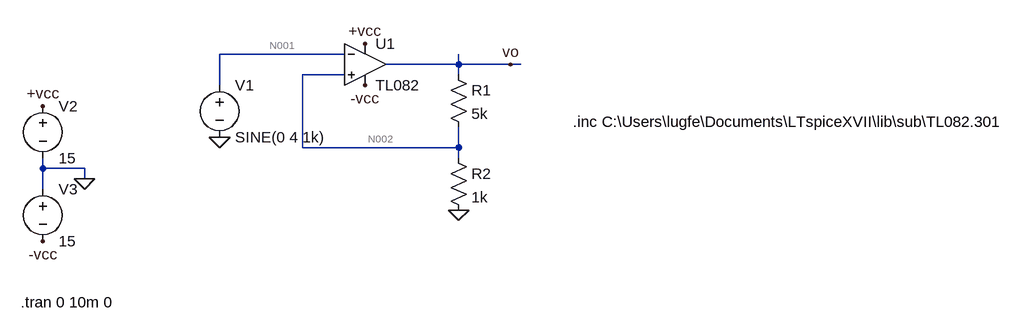
[diagram p0: schematic Draft3.asc]
Draft3.asc, the LTspice schematic file:
Version 4
SHEET 1 1196 680
WIRE 176 48 -16 48
WIRE 352 64 352 48
WIRE 352 64 240 64
WIRE 432 64 352 64
WIRE 448 64 432 64
WIRE 176 80 112 80
WIRE 352 80 352 64
WIRE -16 96 -16 48
WIRE 112 192 112 80
WIRE 352 192 352 160
WIRE 352 192 112 192
WIRE 352 208 352 192
WIRE -288 224 -288 208
WIRE -224 224 -288 224
WIRE -224 240 -224 224
WIRE -288 256 -288 224
FLAG -224 240 0
FLAG -288 336 -vcc
FLAG -288 128 +vcc
FLAG 208 32 +vcc
FLAG 352 288 0
FLAG -16 176 0
FLAG 432 64 vo
FLAG 208 96 -vcc
SYMBOL voltage -16 80 R0
WINDOW 123 24 124 Left 2
WINDOW 39 0 0 Left 0
SYMATTR InstName V1
SYMATTR Value SINE(0 4 1k)
SYMBOL Opamps\\opamp2 208 0 R0
SYMATTR InstName U1
SYMATTR Value TL082
SYMBOL voltage -288 112 R0
WINDOW 123 0 0 Left 0
WINDOW 39 0 0 Left 0
SYMATTR InstName V2
SYMATTR Value 15
SYMBOL voltage -288 240 R0
WINDOW 123 0 0 Left 0
WINDOW 39 0 0 Left 0
SYMATTR InstName V3
SYMATTR Value 15
SYMBOL res 336 64 R0
SYMATTR InstName R1
SYMATTR Value 5k
SYMBOL res 336 192 R0
SYMATTR InstName R2
SYMATTR Value 1k
TEXT 528 152 Left 2 !.inc C:\\Users\\lugfe\\Documents\\LTspiceXVII\\lib\\sub\\TL082.301
TEXT -322 430 Left 2 !.tran 0 10m 0

The netlist it stands for:
* Draft3.asc
V1 N001 0 SINE(0 4 1k)
XU1 N002 N001 +vcc -vcc vo TL082  ; pins In+ In- V+ V- OUT
V2 +vcc 0 15
V3 0 -vcc 15
R1 vo N002 5k
R2 N002 0 1k
.inc C:\Users\lugfe\Documents\LTspiceXVII\lib\sub\TL082.301
.tran 0 10m 0
.backanno
.end

* Results of the author's LTspice run, read from the files saved beside the schematic
* Operating Point, zero values left out:
*   V(vo) = 13.48 V
*   V(-vcc) = -15 V
*   V(+vcc) = 15 V
*   V(n002) = 2.246 V
*   I(R2) = 2.246 mA
*   I(R1) = 2.246 mA
*   I(V3) = -14.19 mA
*   I(V2) = -14.01 mA
*   I(V1) = -44.41 pA
*   Ix(u1:1) = 49.64 pA
*   Ix(u1:2) = 44.41 pA
*   Ix(u1:3) = 14.01 mA
*   Ix(u1:4) = -14.19 mA
*   Ix(u1:5) = -2.246 mA
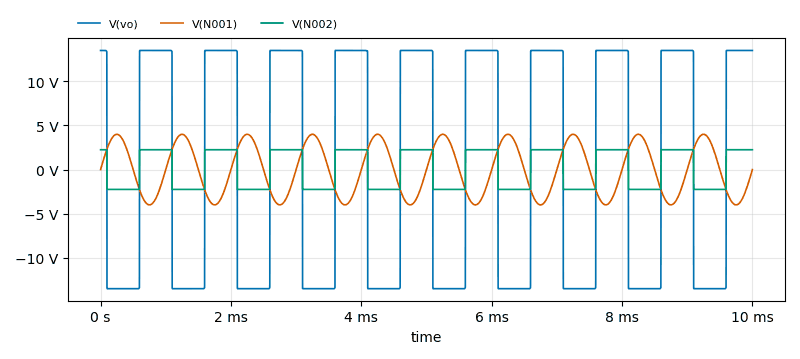
[diagram p1: Transient Analysis of Draft3.asc, plotted from the saved traces]
* Transient Analysis, 1 run:
*   V(vo): min -13.49 V, max 13.49 V, average 190 µV, rms 13.45 V, last 13.48 V
*   V(N001): min -3.996 V, max 3.996 V, average -12.99 µV, rms 2.826 V, last 0 V
*   V(N002): min -2.248 V, max 2.248 V, average 31.62 µV, rms 2.242 V, last 2.246 V